# EAGLE design Lora-Breakout (EAGLE 7.3.0)
ABBREV: rf1; PROJECT: RFM12B Board
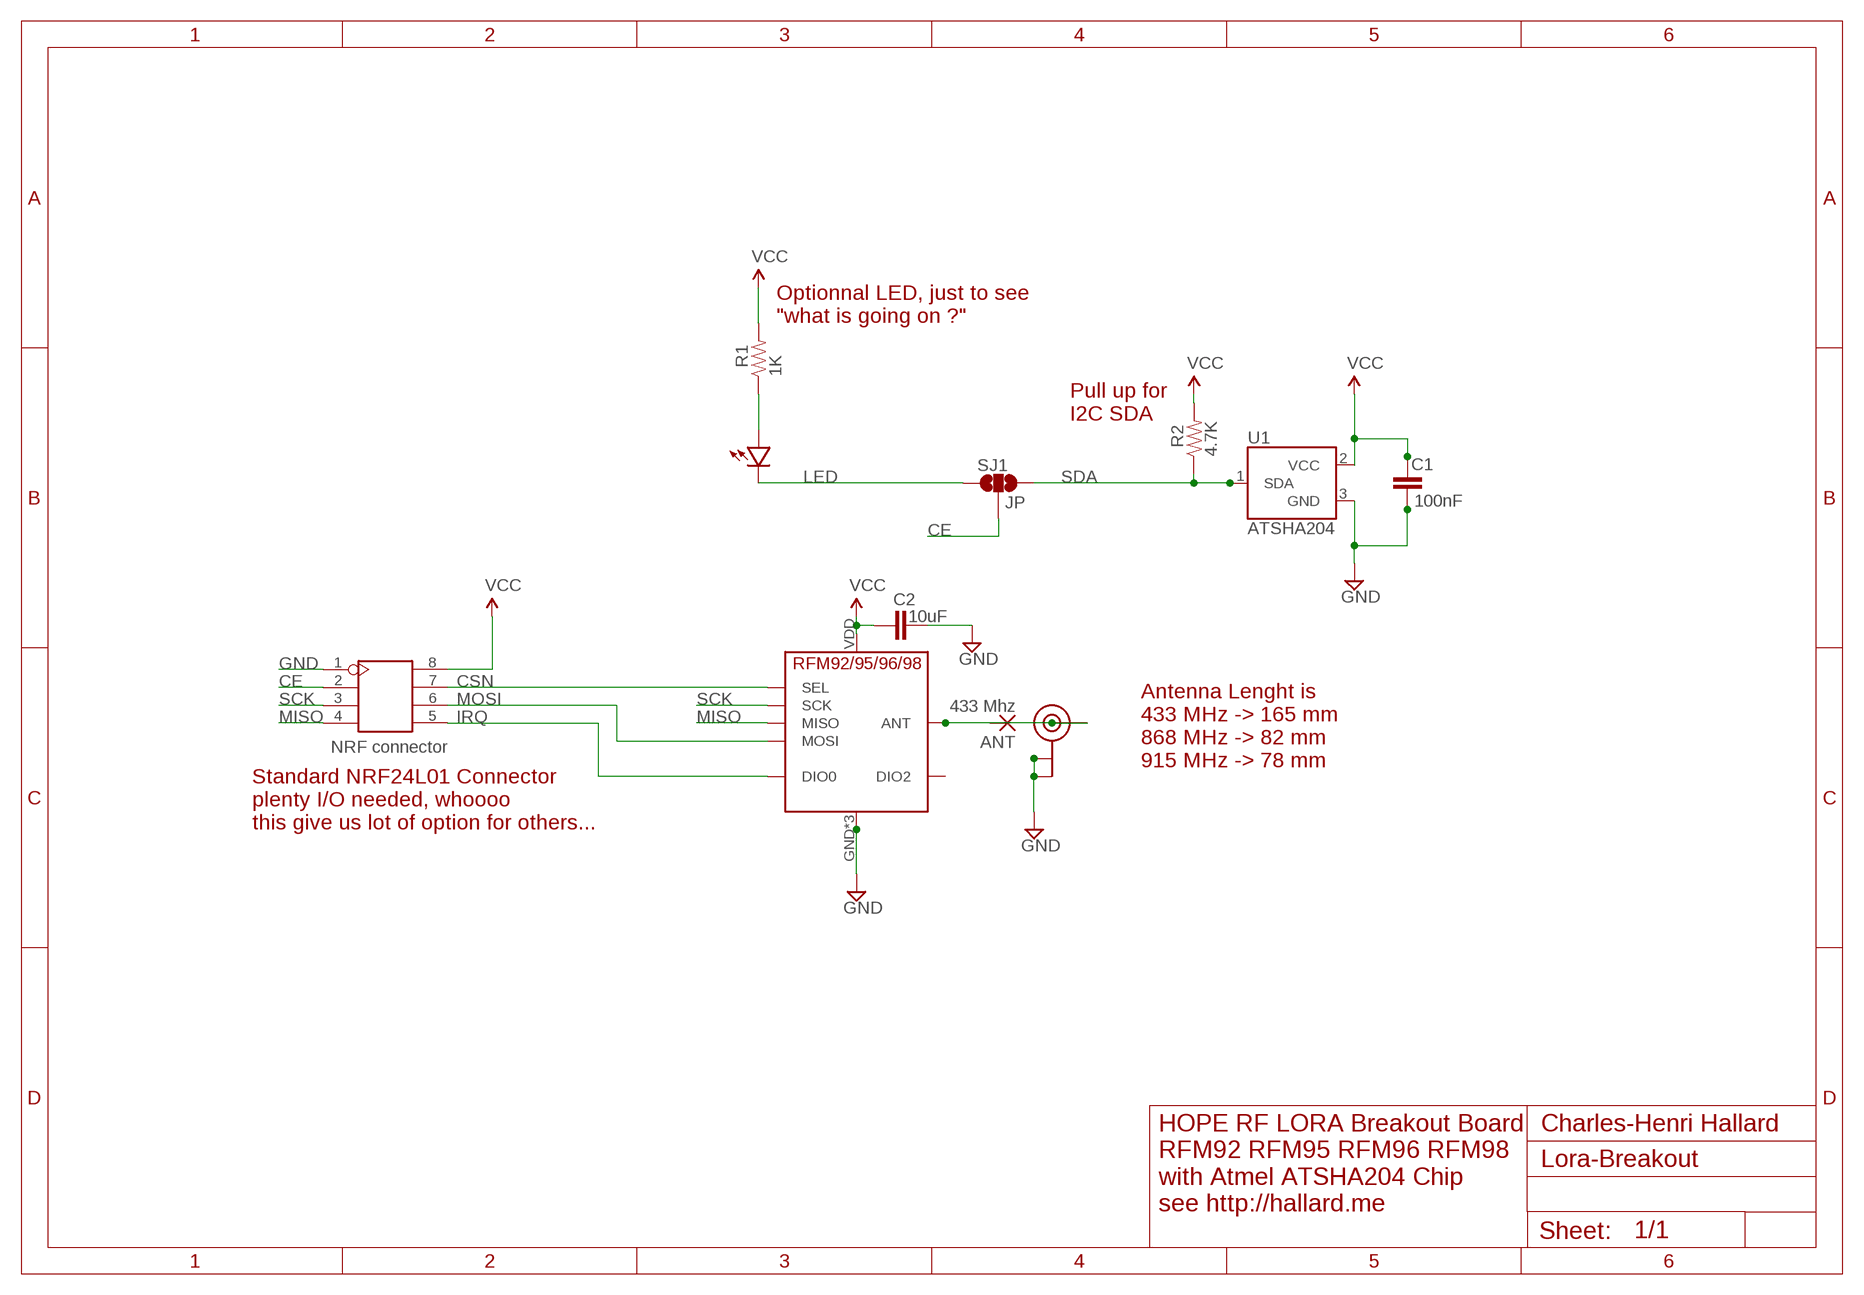
[diagram p0: schematic, sheet 1]

## Parts
ANT  433 Mhz  1,6/0,8  [1,6/0,8]
C1  100nF  CAP0805-CAP  [0805-CAP]
C2  10uF  CAP0805-CAP  [0805-CAP]
J1  NRF connector  HEADER-2X4P-2.54  [2X4P-2.54]
R1  1K  RESISTOR0805-RES  [0805-RES]
R2  4.7K  RESISTOR0805-RES  [0805-RES]
SJ1  JP  JUMPER-PAD-3-NOYES_SILK  [PAD-JUMPER-3-NO_YES_SILK]
U1  ATSHA204  ATSHA204-TSU  [SOT23-3]
U$1  LED0805-LARGE  [0805-LED-LARGEPADS]
U$3  RFM95  [RFM95]
U-FL  U.FL  [U.FL]

## Nets
CE: J1.2 SJ1.2
CSN: J1.7 U$3.NSS(SEL)
GND [power]: C1.2 C2.2 J1.1 U1.3(GND) U$3.GND U$3.GND1(GND) U$3.GND2(GND) U-FL.1(GND) U-FL.2(GND)
IRQ: J1.5 U$3.DIO0
LED: SJ1.1 U$1.MINUS
MISO: J1.4 U$3.MISO
MOSI: J1.6 U$3.MOSI
N$1: ANT.1(P) U$3.ANT U-FL.3(SIGNAL)
N$2: R1.1 U$1.PLUS
SCK: J1.3 U$3.SCK
SDA: R2.1 SJ1.3 U1.1(SDA)
VCC [power]: C1.1 C2.1 J1.8 R1.2 R2.2 U1.2(VCC) U$3.VDD(VCC)
Unconnected: U$3.DIO2

## Notes on the sheet
- Optionnal LED, just to see
  "what is going on ?"
- Pull up for
  I2C SDA
- Antenna Lenght is
  433 MHz -> 165 mm
  868 MHz -> 82 mm
  915 MHz -> 78 mm
- Standard NRF24L01 Connector
  plenty I/O needed, whoooo
  this give us lot of option for others...
- Charles-Henri Hallard
- HOPE RF LORA Breakout Board
  RFM92 RFM95 RFM96 RFM98 
  with Atmel ATSHA204 Chip 
  see http://hallard.me

## Library data of the parts
ANT = JeeLabs:1,6/0,8: THROUGH-HOLE PAD
C1 C2 = _c2h:CAP: Capacitor Standard 0603 ceramic capacitor, and 0.1" leaded capacitor.
J1 = Seeed-Connector:HEADER-2X4P
R1 R2 = _c2h:RESISTOR: Resistor Basic schematic elements and footprints for 0603, 1206, and PTH resistors.
SJ1 = SparkFun-Passives:JUMPER-PAD-3-NO
U1 = SparkFun-DigitalIC:ATSHA204: Atmel ATSHA204 The Atmel ATSHA204 is an optimized authentication chip that includes a 4.5Kb EEPROM. This array can be used for storage of keys, miscellaneous read/write, read-only, password or secret data, and consumption tracking. Access to the various sections of memory can be restricted in a variety of ways and then the configuration locked to prevent changes.
U$1 = _c2h:LED
U$3 = _c2h:RFM95
U-FL = microbuilder:U.FL: U.FL Antenna Connector

## Net classes
1 power: width 0.203 mm, drill 0.305 mm, clearance 0.152 mm

## Board
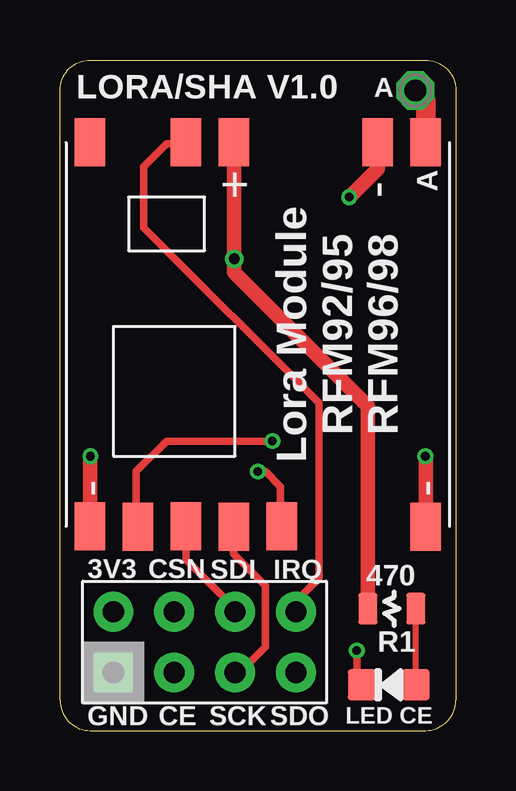
[diagram p1: board, top side]
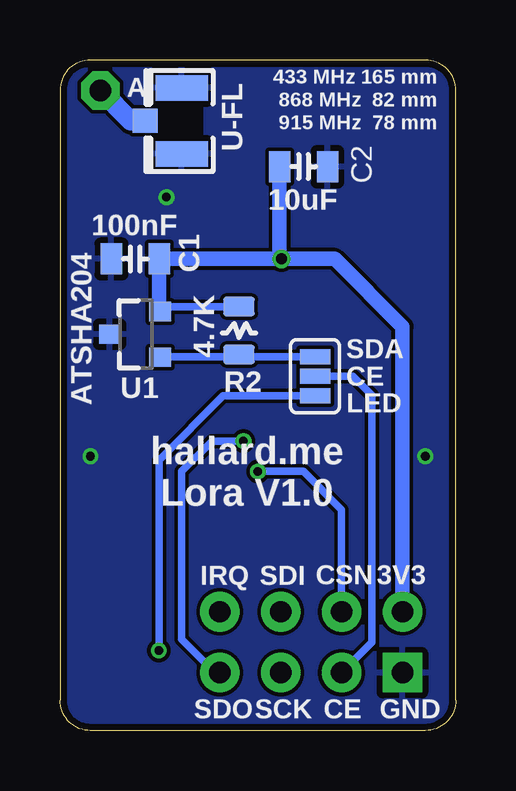
[diagram p2: board, bottom side, seen from below]

Size 16.51 x 27.94 mm. Coordinates in mm from the lower left corner, seen from the top.
Outline: 0,26.67 0,1.27 arc90 1.27,0 15.24,0 arc90 16.51,1.27 16.51,26.67
Outline: 0,26.67 0,26.72
Outline: 16.51,26.72 16.51,26.67
Outline: 0,26.67 arc-90 1.27,27.94 15.24,27.94 arc-90 16.51,26.67
Copper layers (1*16): Top 0.035mm / dielectric 1.5mm / Bottom 0.035mm
Design rules "SeeedStudio_2layer_DRU_no_angle_20140221": minimum track width 6mil, minimum drill 12mil, track to track 6mil, track to pad 6mil, pad to pad 6mil, via to via 6mil, smd to smd 0mil, copper to edge 10mil, drill to drill 10mil, minimum pad ring 10mil, minimum via ring 6mil, stop-mask expansion 2mil, vias tented up to drill 100mil, thermal gap 10mil

### Footprints (pad centres in the part's own frame; a part is rotated, then mirrored left to right if it is on the bottom)
1,6/0,8 = drill 0.9 pad 1.6 octagon: 1 0,0
0805-CAP = smd 0.902 x 1.3: 1 -1,0; 2 1,0
2X4P-2.54 = drill 0.889 pad 1.651 square: 1 -1.27,3.81 | drill 0.889 pad 1.651: 2 -1.27,1.27; 3 -1.27,-1.27; 4 -1.27,-3.81; 5 1.27,-3.81; 6 1.27,-1.27; 7 1.27,1.27; 8 1.27,3.81
0805-RES = smd 0.8 x 1.3: 1 -1,0; 2 1,0
PAD-JUMPER-3-NO_YES_SILK = smd 0.635 x 1.27: 1 -0.813,0; 2 0,0; 3 0.813,0
SOT23-3 = smd 0.8 x 0.9: 1 -0.95,-1; 2 0.95,-1; 3 0,1.1
0805-LED-LARGEPADS = smd 1.156 x 1.3: MINUS -1.127,0; PLUS 1.127,0
RFM95 = smd 2 x 1.27: ANT 5.777,-7; DIO0 5.777,3; DIO2 5.779,7; GND 5.777,-5; GND1 -10.223,7; GND2 -10.23,-7; MISO -10.23,5; MOSI -10.225,3; NSS -10.223,-1; SCK -10.23,1.012; VDD 5.777,1
U.FL = smd 2.2 x 1.05: 1 0,1.375; 2 0,-1.375 | smd 1.05 x 1: 3 1.525,0

### Placement (x,y rotation side)
ANT  14.82,26.67 0 top
C1  13.37,19.65 180 bottom
C2  6.35,23.5 0 bottom
J1  6.03,3.68 90 top
R1  13.84,5.08 180 top
R2  9.05,16.67 90 bottom
SJ1  5.87,14.76 90 bottom
U1  13.34,16.51 90 bottom
U$1  13.72,1.91 0 top
U$3  8.26,18.73 90 top
U-FL  11.43,25.4 180 bottom

### Tracks (layer width: path | path; a pad name or v marks a point on that pad's centre or on a via)
CE
  Bottom 0.305: J1.2 3.49,3.68 3.49,13.97 4.29,14.76 SJ1.2
CSN  (via drill 0.36)
  Top 0.305: v8.26,10.79 8.57,10.79 9.21,10.16 9.21,8.56 U$3.NSS
  Bottom 0.305: J1.7 4.76,9.21 6.35,10.79 v8.26,10.79
GND  (via drill 0.36)
  Top 0.61: U$3.GND1 1.25,11.41 v1.27,11.43 | U$3.GND2 15.26,11.41 v15.24,11.43 | U$3.GND 13.26,23.41 v12.06,22.23
  pour Bottom: -1.08,-1.08 -1.08,28.31 17.84,28.31 17.84,-1.08
IRQ
  Top 0.203: J1.5 9.84,4.89
  Top 0.305: J1.5 9.84,5.4 10.79,6.35 10.79,13.65 3.49,20.95 3.49,23.5 4.45,24.45 5.19,24.45 U$3.DIO0
LED  (via drill 0.36)
  Top 0.305: v12.38,3.33 12.38,2.11 U$1.MINUS
  Bottom 0.305: SJ1.1 9.7,13.95 12.38,11.27 v12.38,3.33
MISO  (via drill 0.36)
  Top 0.305: v8.86,12.06 4.45,12.06 3.17,10.79 3.17,8.58 U$3.MISO
  Bottom 0.305: J1.4 10.03,2.41 11.43,3.81 11.43,10.79 10.16,12.06 v8.86,12.06
MOSI
  Top 0.305: J1.6 7.3,5.08 5.25,7.13 U$3.MOSI
N$1
  Top 0.813: U$3.ANT 15.26,26.24 ANT.1
  Bottom 0.813: U-FL.3 13.55,25.4 ANT.1
N$2
  Top 0.254: U$1.PLUS R1.1
SCK
  Top 0.305: J1.3 7.49,2.41 8.57,3.49 8.57,6.03 7.24,7.36 U$3.SCK
SDA
  Bottom 0.254: R2.1 8.64,15.67 8.73,15.58
  Bottom 0.305: SJ1.3 8.73,15.58 12,15.58 U1.1
VCC  (via drill 0.46)
  Top 0.61: R1.2 12.84,13.51 7.25,19.1 7.25,19.64 v7.27,19.65 7.25,19.67 U$3.VDD
  Bottom 0.305: R2.2 11.81,17.67 U1.2
  Bottom 0.61: J1.8 2.22,16.83 5.05,19.65 v7.27,19.65 | U1.2 12.37,17.9 C1.1 v7.27,19.65 | 7.25,19.67 v7.27,19.65 | C2.1 7.35,19.73 v7.27,19.65

### Text on the board
tNames: LORA/SHA V1.0 | A | Lora Module / RFM92/95 / RFM96/98 | 3V3 | CSN | SDI | IRQ | 470 | R1 | GND | CE | SCK | SDO | LED CE
bNames: 433 MHz 165 mm | 868 MHz 82 mm | 915 MHz 78 mm | A | 100nF | SDA | CE | LED | hallard.me / Lora V1.0 | 3V3 | CSN | SDI | IRQ | GND | CE | SCK | SDO